# EAGLE design JeeLabs-precision-RTC (EAGLE 5.12)
ABBREV: pr1; PROJECT: Precision RTC
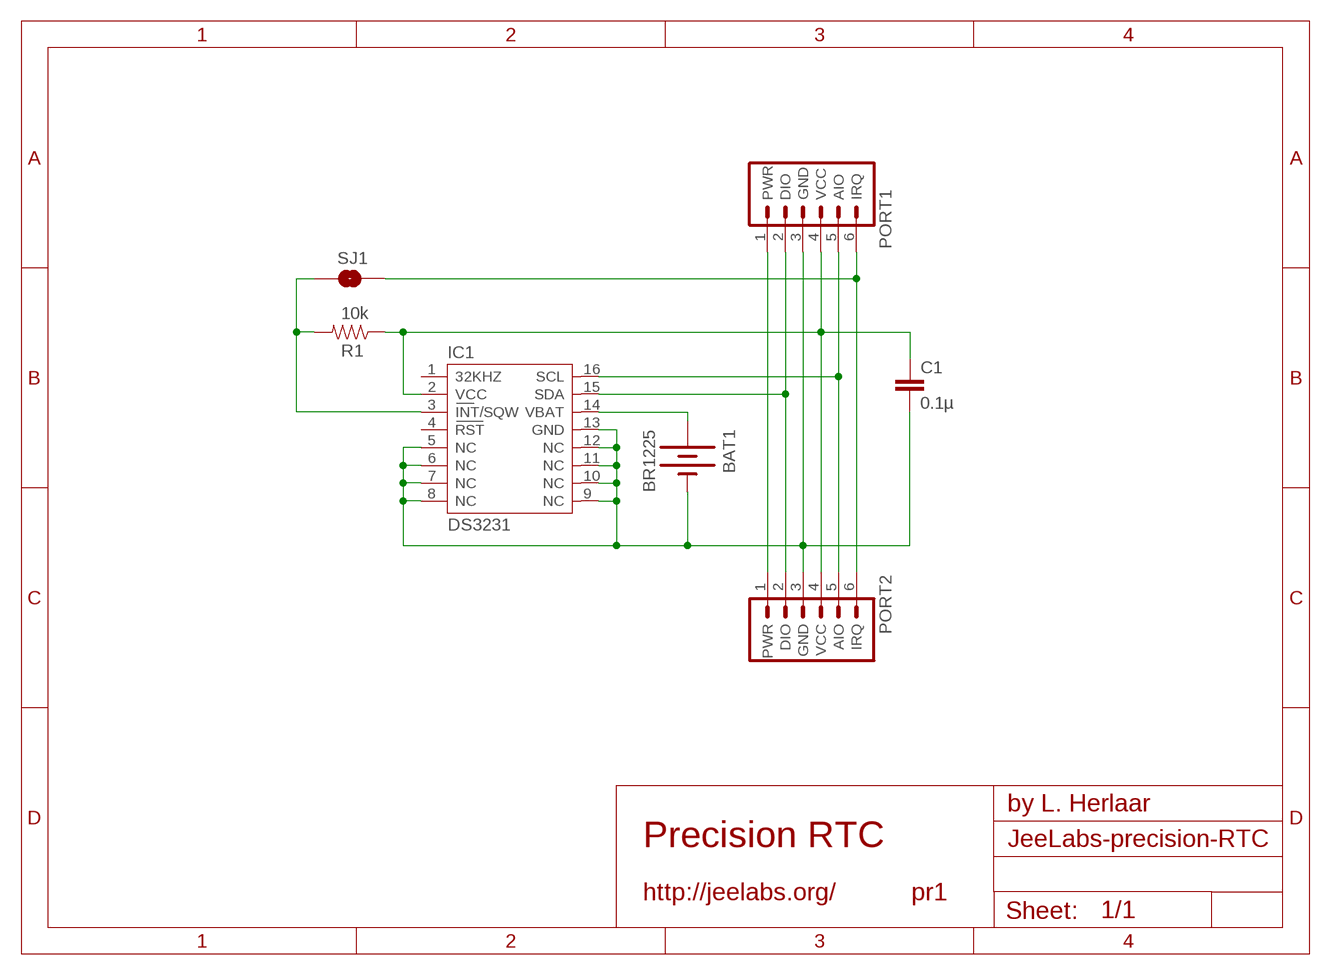
[diagram p0: schematic, sheet 1]

## Parts
BAT1  BR1225  BATTERY12PTH  [BATTCON_12MM_PTH]
C1  0.1µ  CAP0603-CAP  [0603-CAP]
IC1  DS3231  [DS3231]
PORT1  P1  JEEPORT-LONGPADS  [PORT6PIN]
PORT2  P4  JEEPORT-LONGPADS  [PORT6PIN]
R1  10k  RESISTOR0603-RES  [0603-RES]
SJ1  SOLDERJUMPERNO  [SJ_2S-NO]

## Nets
GND [power]: BAT1.GND(-) C1.2 IC1.5(NC) IC1.6(NC) IC1.7(NC) IC1.8(NC) IC1.9(NC) IC1.10(NC) IC1.11(NC) IC1.12(NC) IC1.13(GND) PORT1.3(GND) PORT2.3(GND)
N$1: BAT1.VCC@1(+) IC1.14(VBAT)
N$2: IC1.15(SDA) PORT1.2(DIO) PORT2.2(DIO)
N$3: IC1.3(INT/SQW) R1.2 SJ1.2
N$5: IC1.16(SCL) PORT1.5(AIO) PORT2.5(AIO)
N$6: PORT1.6(IRQ) PORT2.6(IRQ) SJ1.1
PWR [power]: PORT1.1(PWR) PORT2.1(PWR)
VCC [power]: C1.1 IC1.2(VCC) PORT1.4(VCC) PORT2.4(VCC) R1.1
Unconnected: IC1.1(32KHZ) IC1.4(RST)

## Library data of the parts
BAT1 = SparkFun:BATTERY: Battery Holders Various common sizes : AA, AAA, 20mm coin cell and 12mm coin cell.
C1 = _SparkFun:CAP: Capacitor Standard 0603 ceramic capacitor, and 0.1" leaded capacitor.
IC1 = _lh-library:DS3231
PORT1 PORT2 = _JeeLabs:JEEPORT: PIN HEADER
R1 = _SparkFun:RESISTOR: Resistor Basic schematic elements and footprints for 0603, 1206, and PTH resistors.
SJ1 = _SparkFun:SOLDERJUMPER: Solder Jumper Standard SMD solder jumper. Used to automate production. Two varients : Normally Open and Normally Closed are the same, but have different paste layers. NC will have a large amount of paste and should jumper during reflow.

## Net classes
0 default: width 0.203 mm, clearance 0.203 mm
1 power: width 0.381 mm, clearance 0.254 mm

## Board
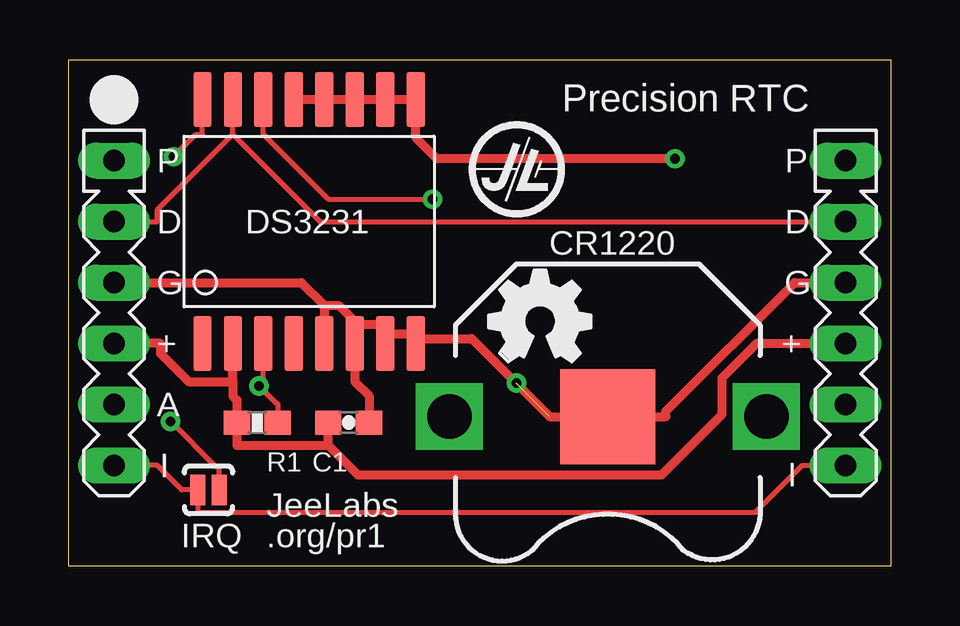
[diagram p1: board, top side]
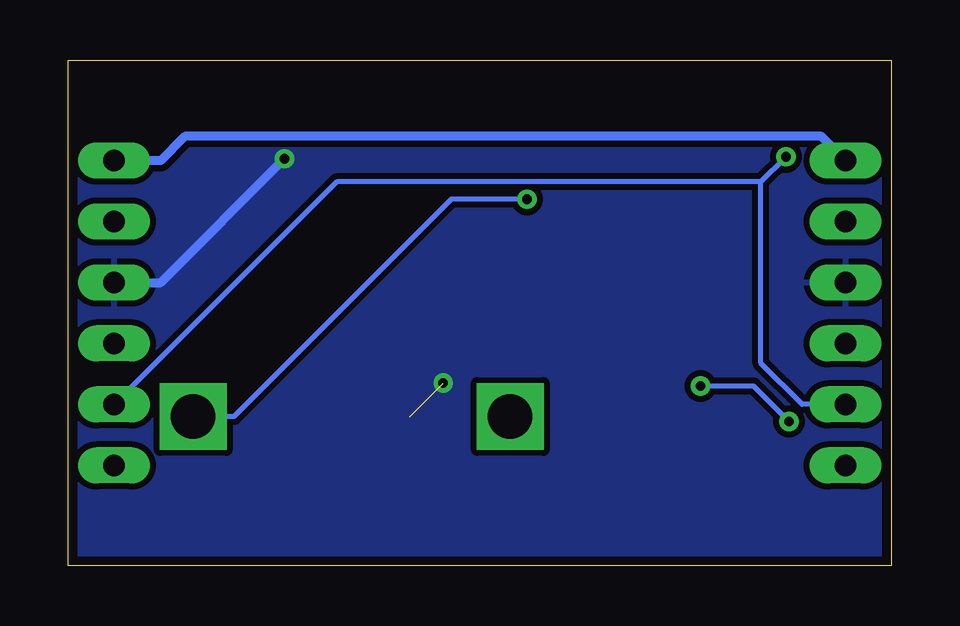
[diagram p2: board, bottom side, seen from below]

Size 34.29 x 21.08 mm. Coordinates in mm from the lower left corner, seen from the top.
Outline: 0,0 34.29,0 34.29,21.08 0,21.08 0,0
Copper layers (1*16): Top 0.035mm / dielectric 1.5mm / Bottom 0.035mm
Design rules "lh-jl *": minimum track width 8mil, minimum drill 0.4mm, track to track 8mil, track to pad 8mil, pad to pad 8mil, via to via 8mil, smd to smd 8mil, copper to edge 15mil, drill to drill 0.4mm, minimum pad ring 0.3mm, minimum via ring 8mil, stop-mask expansion 4mil, vias tented up to drill 20mil, thermal gap 10mil

### Footprints (pad centres in the part's own frame; a part is rotated, then mirrored left to right if it is on the bottom)
BATTCON_12MM_PTH = smd 3.962 x 3.962: GND 0,0 | drill 1.854 square: VCC@1 -6.604,0; VCC@2 6.604,0
0603-CAP = smd 1.1 x 1: 1 -0.85,0; 2 0.85,0
DS3231 = smd 0.762 x 2.286: 1 -4.445,-5.08; 2 -3.175,-5.08; 3 -1.905,-5.08; 4 -0.635,-5.08; 5 0.635,-5.08; 6 1.905,-5.08; 7 3.175,-5.08; 8 4.445,-5.08; 9 4.445,5.08; 10 3.175,5.08; 11 1.905,5.08; 12 0.635,5.08; 13 -0.635,5.08; 14 -1.905,5.08; 15 -3.175,5.08; 16 -4.445,5.08
PORT6PIN = drill 0.9 long: 1 -6.35,0; 2 -3.81,0; 3 -1.27,0; 4 1.27,0; 5 3.81,0; 6 6.35,0
0603-RES = smd 1.1 x 1: 1 -0.85,0; 2 0.85,0
SJ_2S-NO = smd 0.635 x 1.27: 1 -0.45,0; 2 0.45,0

### Placement (x,y rotation side)
BAT1  22.48,6.22 180 top
C1  11.68,5.97 0 top
IC1  10.03,14.35 0 top
LOGO1  OSHW_LOGO_FILLX0150-NT  [OSHW_FILLX150_NOTEXT]  17.53,8.51 0 top
PORT1  1.91,10.54 270 top
PORT2  32.39,10.54 270 top
R1  7.87,5.97 0 top
SJ1  5.84,3.17 0 top

### Tracks (layer width: path | path; a pad name or v marks a point on that pad's centre or on a via)
GND  (via drill 0.4 pad 0.81)  (1 unrouted)
  Top 0.381: v25.28,16.97 15.35,16.97 14.48,17.84 IC1.9 IC1.10 IC1.11 IC1.12 IC1.13 | PORT1.3 9.72,11.81 10.67,10.86 | 11.94,10.07 11.94,10.19 11.27,10.86 10.67,10.86 | 11.94,10.07 IC1.6 11.94,7.68 12.53,7.09 C1.2 | 11.94,10.07 13.21,10.07 13.21,9.67 | 10.67,10.86 IC1.5 | 14.48,9.47 16.81,9.47 20.05,6.22 BAT1.GND 24.9,6.22 24.9,6.45 30.26,11.81 PORT2.3 | 14.48,9.47 14.48,9.67 13.21,9.67 | 14.48,9.47 IC1.8 | 13.21,9.67 IC1.7
  Bottom 0.381: v25.28,16.97 30.44,11.81 PORT2.3
  other vias: 18.67,7.62
  pour Bottom: 0,21.08 34.29,21.08 34.29,0 0,0
N$1  (via drill 0.4 pad 0.81)
  Top 0.203: IC1.14 8.13,17.98 10.83,15.28 v15.17,15.28
  Bottom 0.203: BAT1.VCC@1 27.39,6.22 18.33,15.28 v15.17,15.28
N$2
  Top 0.203: PORT1.2 3.71,14.35 3.71,14.84 6.86,17.98 | PORT2.2 10.49,14.35 6.86,17.98 | 6.86,17.98 IC1.15
N$3  (via drill 0.4 pad 0.81)
  Top 0.203: SJ1.2 6.29,4.11 6.17,4.11 v4.26,6.02 | IC1.3 8.13,7.82 7.95,7.65 v7.95,7.5 8.68,6.77 8.72,6.77 R1.2
  Bottom 0.203: v4.26,6.02 5.74,7.5 v7.95,7.5
N$5  (via drill 0.4 pad 0.81)
  Top 0.203: IC1.16 5.59,17.98 5.31,17.98 v4.38,17.05
  Bottom 0.203: 5.43,16 v4.38,17.05 | PORT2.5 23.11,16 5.43,16 | 5.43,16 5.43,8.45 3.71,6.73 PORT1.5
N$6
  Top 0.203: PORT2.6 30.58,4.19 28.62,2.24 5.39,2.24 SJ1.1 4.73,3.17 3.71,4.19 PORT1.6
PWR
  Bottom 0.381: PORT1.1 2.91,17.9 29.43,17.9 30.44,16.89 PORT2.1
VCC
  Top 0.381: 10.83,5.02 7.02,5.02 R1.1 7.02,6.28 7.02,6.91 6.86,7.08 6.86,7.68 | 6.86,7.68 5.01,7.68 3.85,8.85 3.85,9.27 PORT1.4 | 6.86,7.68 IC1.2 | PORT2.4 30.44,9.27 28.68,9.27 27.25,7.84 27.25,6.32 24.72,3.8 12.06,3.8 10.83,5.02 | 10.83,5.02 C1.1

### Text on the board
tPlace: Precision RTC | P | P | D | DS3231 | CR1220 | D | G | G | + | + | A | I | R1 | C1 | I | JeeLabs | IRQ | .org/pr1